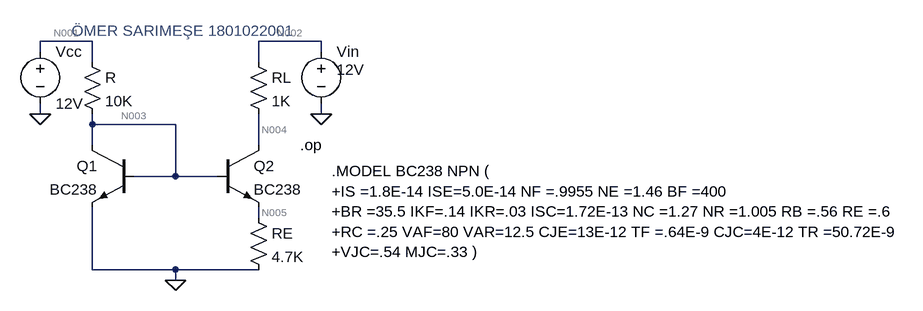
[diagram p0: schematic Draft1.asc]
Draft1.asc, the LTspice schematic file:
Version 4
SHEET 1 1344 680
WIRE 32 -32 -48 -32
WIRE 384 -32 288 -32
WIRE -48 -16 -48 -32
WIRE 384 -16 384 -32
WIRE 32 0 32 -32
WIRE 288 0 288 -32
WIRE -48 80 -48 64
WIRE 384 80 384 64
WIRE 32 96 32 80
WIRE 160 96 32 96
WIRE 32 128 32 96
WIRE 288 128 288 80
WIRE 160 176 160 96
WIRE 160 176 96 176
WIRE 224 176 160 176
WIRE 288 240 288 224
WIRE 32 320 32 224
WIRE 160 320 32 320
WIRE 288 320 160 320
WIRE 160 336 160 320
FLAG 160 336 0
FLAG -48 80 0
FLAG 384 80 0
SYMBOL npn 96 128 M0
SYMATTR InstName Q1
SYMATTR Value BC238
SYMBOL npn 224 128 R0
SYMATTR InstName Q2
SYMATTR Value BC238
SYMBOL res 16 -16 R0
SYMATTR InstName R
SYMATTR Value 10K
SYMBOL res 272 -16 R0
SYMATTR InstName RL
SYMATTR Value 1K
SYMBOL voltage -48 -32 R0
WINDOW 123 0 0 Left 0
WINDOW 39 0 0 Left 0
SYMATTR InstName Vcc
SYMATTR Value 12V
SYMBOL voltage 384 -32 R0
WINDOW 3 24 44 Left 2
WINDOW 123 0 0 Left 0
WINDOW 39 0 0 Left 0
SYMATTR InstName Vin
SYMATTR Value 12V
SYMBOL res 272 224 R0
SYMATTR InstName RE
SYMATTR Value 4.7K
TEXT 400 168 Left 2 !.MODEL BC238 NPN (\n+IS =1.8E-14 ISE=5.0E-14 NF =.9955 NE =1.46 BF =400\n+BR =35.5 IKF=.14 IKR=.03 ISC=1.72E-13 NC =1.27 NR =1.005 RB =.56 RE =.6\n+RC =.25 VAF=80 VAR=12.5 CJE=13E-12 TF =.64E-9 CJC=4E-12 TR =50.72E-9\n+VJC=.54 MJC=.33 )
TEXT 0 -48 Left 2 ;ÖMER SARIMEŞE 1801022001
TEXT 352 128 Left 2 !.op

The netlist it stands for:
* Draft1.asc
Q1 N003 N003 0 0 BC238
Q2 N004 N003 N005 0 BC238
R N001 N003 10K
RL N002 N004 1K
Vcc N001 0 12V
Vin N002 0 12V
RE N005 0 4.7K
.model NPN NPN
.model PNP PNP
.lib standard.bjt
.MODEL BC238 NPN (
+IS =1.8E-14 ISE=5.0E-14 NF =.9955 NE =1.46 BF =400
+BR =35.5 IKF=.14 IKR=.03 ISC=1.72E-13 NC =1.27 NR =1.005 RB =.56 RE =.6
+RC =.25 VAF=80 VAR=12.5 CJE=13E-12 TF =.64E-9 CJC=4E-12 TR =50.72E-9
+VJC=.54 MJC=.33 )
* ÖMER SARIMEŞE 1801022001
.op
.backanno
.end

* Results of the author's LTspice run, read from the files saved beside the schematic
* Operating Point:
*   V(n003) = 642.5 mV
*   V(n004) = 11.98 V
*   V(n005) = 105.7 mV
*   V(n001) = 12 V
*   V(n002) = 12 V
*   Ic(Q2) = 22.36 µA
*   Ib(Q2) = 125.4 nA
*   Ie(Q2) = -22.49 µA
*   Ic(Q1) = 1.131 mA
*   Ib(Q1) = 4.209 µA
*   Ie(Q1) = -1.136 mA
*   I(Re) = 22.49 µA
*   I(Rl) = 22.36 µA
*   I(R) = 1.136 mA
*   I(Vin) = -22.36 µA
*   I(Vcc) = -1.136 mA
* From the log:
*   Semiconductor Device Operating Points:
*                           --- Bipolar Transistors ---
*   Name:       q2          q1
*   Model:     bc238       bc238
*   Ib:       1.25e-07    4.21e-06
*   Ic:       2.24e-05    1.13e-03
*   Vbe:      5.37e-01    6.42e-01
*   Vbc:     -1.13e+01    0.00e+00
*   Vce:      1.19e+01    6.42e-01
*   BetaDC:   1.78e+02    2.69e+02
*   Gm:       8.67e-04    4.35e-02
*   Rpi:      2.53e+05    6.73e+03
*   Rx:       5.60e-01    5.60e-01
*   Ro:       3.93e+06    6.71e+04
*   Cbe:      1.92e-11    4.80e-11
*   Cbc:      1.44e-12    4.00e-12
*   Cjs:      0.00e+00    0.00e+00
*   BetaAC:   2.19e+02    2.92e+02
*   Cbx:      0.00e+00    0.00e+00
*   Ft:       6.67e+06    1.33e+08